# EAGLE schematic schematic (EAGLE 9.6.2)
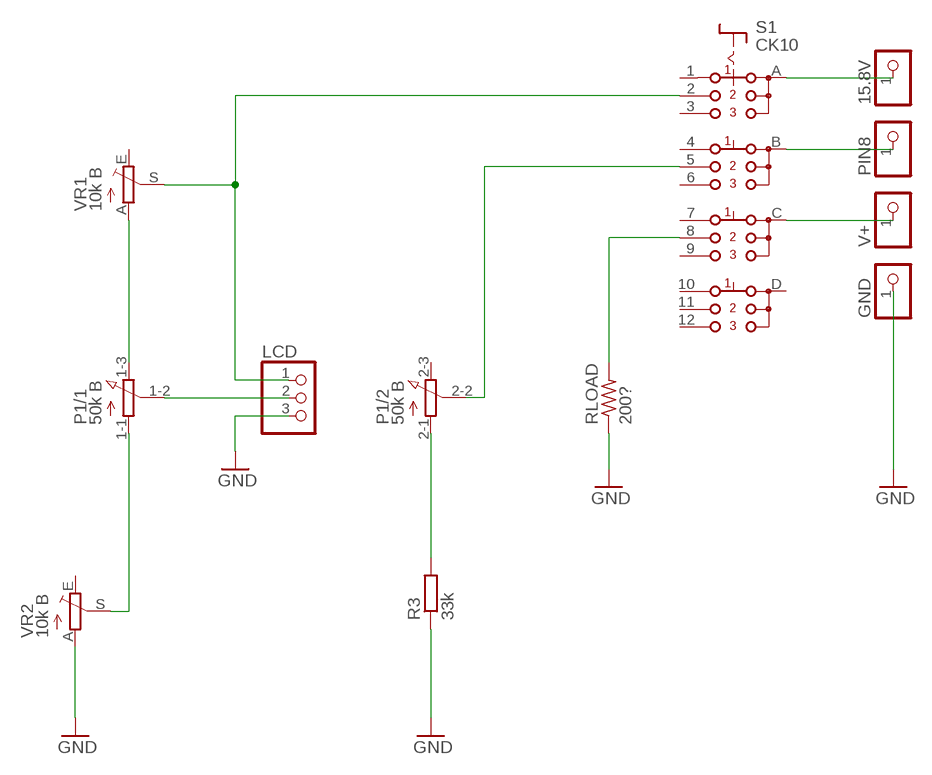
[diagram p0: schematic, sheet 1]

## Parts
15.8V  PINHD-1X1  [1X01]
GND  PINHD-1X1  [1X01]
LCD  PINHD-1X3  [1X03]
P1  50k B  3RP/1610G  [3RP/1610G]
PIN8  PINHD-1X1  [1X01]
R3  33k  R-EU_0204/5  [0204/5]
RLOAD  200?  R-US_VTA52  [VTA52]
S1  CK10  [CK10]
V+  PINHD-1X1  [1X01]
VR1  10k B  TRIM_EU-RJ9W  [RJ9W]
VR2  10k B  TRIM_EU-RJ9W  [RJ9W]

## Nets
GND: GND.1 LCD.3 R3.1 RLOAD.1 VR2.A
N$1: P1.2-2(/2:S) S1.5(B2)
N$2: 15.8V.1 S1.A
N$3: PIN8.1 S1.B
N$4: P1.1-1(/1:A) VR2.S
N$6: LCD.1 S1.2(A2) VR1.S
N$7: P1.1-3(/1:E) VR1.A
N$8: LCD.2 P1.1-2(/1:S)
N$10: S1.C V+.1
N$11: RLOAD.2 S1.8(C2)
N$12: P1.2-1(/2:A) R3.2
Unconnected: P1.2-3(/2:E) S1.1(A1) S1.3(A3) S1.4(B1) S1.6(B3) S1.7(C1) S1.9(C3) S1.10(D1) S1.11(D2) S1.12(D3) S1.D VR1.E VR2.E

## Library data of the parts
15.8V GND PIN8 V+ = pinhead:PINHD-1X1: PIN HEADER
LCD = pinhead:PINHD-1X3: PIN HEADER
P1 = pot:3RP/1610G: 16mm Potentiometer two level Source: http://www.alphapotentiometers.net/html/16mm_pot_2.html
R3 = rcl:R-EU_: RESISTOR, European symbol; SPICEPREFIX: R
RLOAD = rcl:R-US_: RESISTOR, American symbol; SPICEPREFIX: R
S1 = switch:CK10: ROTARY SWITCH C&K
VR1 VR2 = pot:TRIM_EU-: POTENTIOMETER